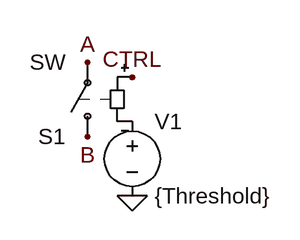
[diagram p0: schematic ctrl_switch.asc]
ctrl_switch.asc, the LTspice schematic file:
Version 4
SHEET 1 880 680
FLAG 192 96 A
FLAG 192 176 B
FLAG 240 112 CTRL
FLAG 240 240 0
SYMBOL sw 192 192 R180
SYMATTR InstName S1
SYMBOL voltage 240 144 R0
SYMATTR InstName V1
SYMATTR Value {Threshold}

The netlist it stands for:
* ctrl_switch.asc
S1 B A CTRL P001 SW
V1 P001 0 {Threshold}
.backanno
.end